# Altium schematic sheet Mainboard_Motordriver_Interface.SchDoc
size A4
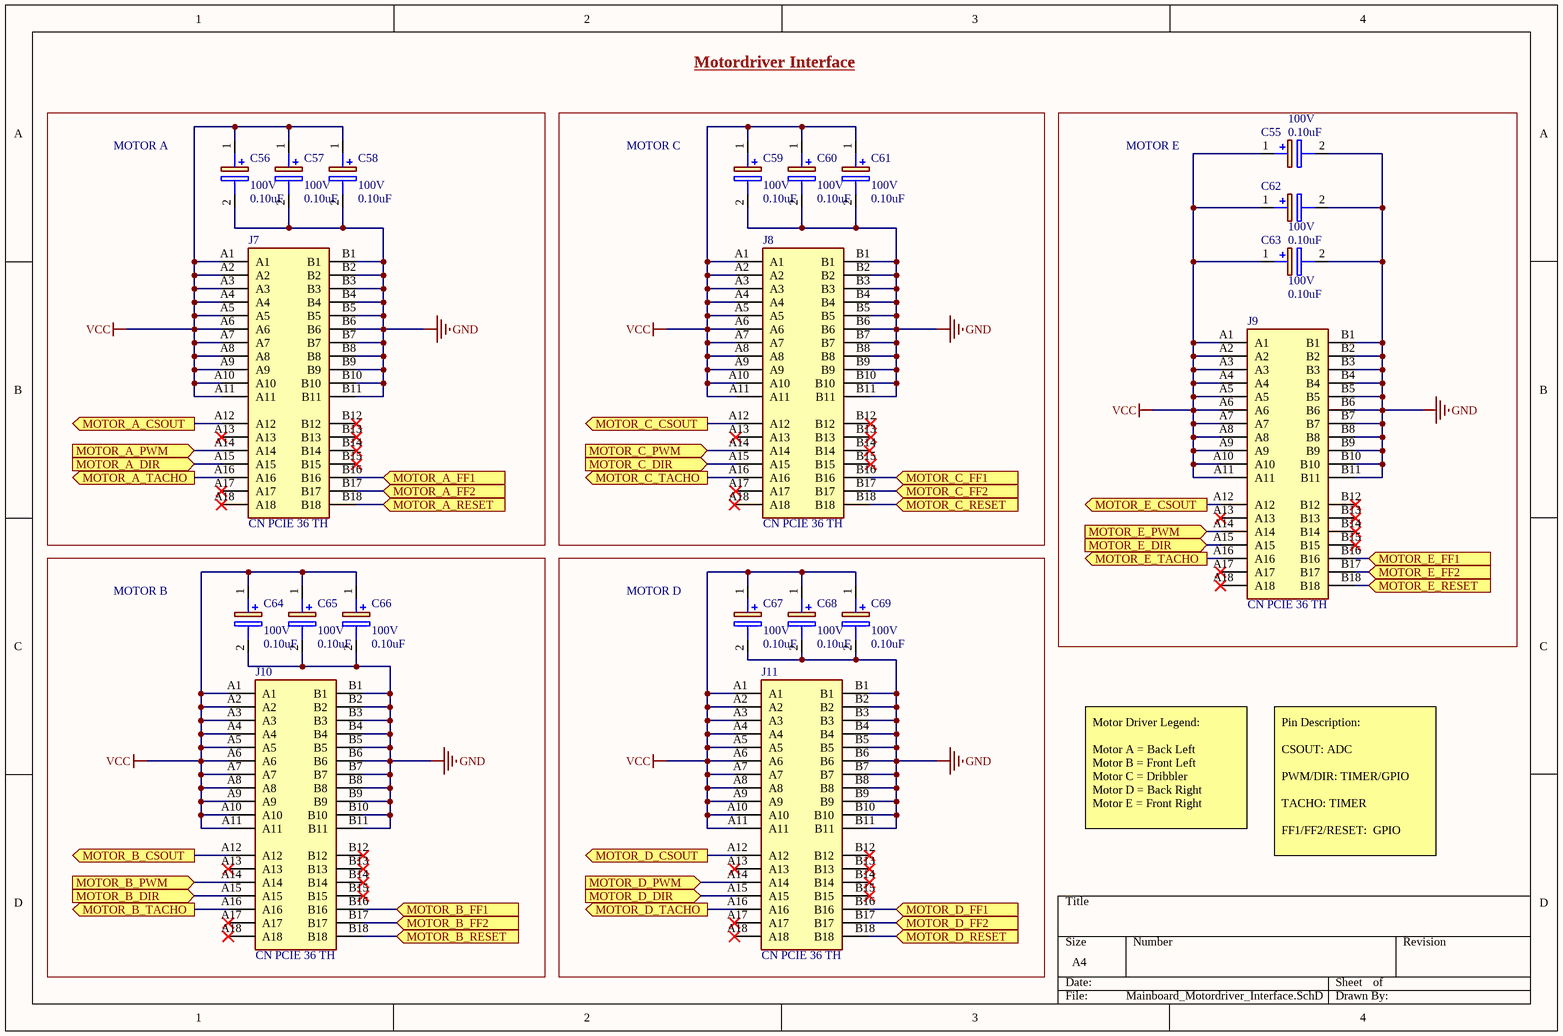
[diagram p0: Mainboard_Motordriver_Interface.SchDoc]

## Parts
C55  value 0.10uF  Rating: 100V  [CAPPRD200W50D525H1250]  (hidden comment: CAP POL 0.1uF 100V)
C56  value 0.10uF  Rating: 100V  [CAPPRD200W50D525H1250]  (hidden comment: CAP POL 0.1uF 100V)
C57  value 0.10uF  Rating: 100V  [CAPPRD200W50D525H1250]  (hidden comment: CAP POL 0.1uF 100V)
C58  value 0.10uF  Rating: 100V  [CAPPRD200W50D525H1250]  (hidden comment: CAP POL 0.1uF 100V)
C59  value 0.10uF  Rating: 100V  [CAPPRD200W50D525H1250]  (hidden comment: CAP POL 0.1uF 100V)
C60  value 0.10uF  Rating: 100V  [CAPPRD200W50D525H1250]  (hidden comment: CAP POL 0.1uF 100V)
C61  value 0.10uF  Rating: 100V  [CAPPRD200W50D525H1250]  (hidden comment: CAP POL 0.1uF 100V)
C62  value 0.10uF  Rating: 100V  [CAPPRD200W50D525H1250]  (hidden comment: CAP POL 0.1uF 100V)
C63  value 0.10uF  Rating: 100V  [CAPPRD200W50D525H1250]  (hidden comment: CAP POL 0.1uF 100V)
C64  value 0.10uF  Rating: 100V  [CAPPRD200W50D525H1250]  (hidden comment: CAP POL 0.1uF 100V)
C65  value 0.10uF  Rating: 100V  [CAPPRD200W50D525H1250]  (hidden comment: CAP POL 0.1uF 100V)
C66  value 0.10uF  Rating: 100V  [CAPPRD200W50D525H1250]  (hidden comment: CAP POL 0.1uF 100V)
C67  value 0.10uF  Rating: 100V  [CAPPRD200W50D525H1250]  (hidden comment: CAP POL 0.1uF 100V)
C68  value 0.10uF  Rating: 100V  [CAPPRD200W50D525H1250]  (hidden comment: CAP POL 0.1uF 100V)
C69  value 0.10uF  Rating: 100V  [CAPPRD200W50D525H1250]  (hidden comment: CAP POL 0.1uF 100V)
J7  CN PCIE 36 TH  [CN PCIE 36 TH]
J8  CN PCIE 36 TH  [CN PCIE 36 TH]
J9  CN PCIE 36 TH  [CN PCIE 36 TH]
J10  CN PCIE 36 TH  [CN PCIE 36 TH]
J11  CN PCIE 36 TH  [CN PCIE 36 TH]

## Blocks framed on the sheet
MOTOR A: C56-C58 J7
MOTOR C: C59-C61 J8
MOTOR E: C55 C62 C63 J9
MOTOR B: C64-C66 J10
MOTOR D: C67-C69 J11

## Ports
MOTOR_A_CSOUT (out), MOTOR_A_DIR (in), MOTOR_A_FF1 (in), MOTOR_A_FF2 (in), MOTOR_A_PWM (in), MOTOR_A_RESET (in), MOTOR_A_TACHO (out), MOTOR_B_CSOUT (out), MOTOR_B_DIR (in), MOTOR_B_FF1 (in), MOTOR_B_FF2 (in), MOTOR_B_PWM (in), MOTOR_B_RESET (in), MOTOR_B_TACHO (out), MOTOR_C_CSOUT (out), MOTOR_C_DIR (in), MOTOR_C_FF1 (in), MOTOR_C_FF2 (in), MOTOR_C_PWM (in), MOTOR_C_RESET (in), MOTOR_C_TACHO (out), MOTOR_D_CSOUT (out), MOTOR_D_DIR (in), MOTOR_D_FF1 (in), MOTOR_D_FF2 (in), MOTOR_D_PWM (in), MOTOR_D_RESET (in), MOTOR_D_TACHO (out), MOTOR_E_CSOUT (out), MOTOR_E_DIR (in), MOTOR_E_FF1 (in), MOTOR_E_FF2 (in), MOTOR_E_PWM (in), MOTOR_E_RESET (in), MOTOR_E_TACHO (out)

## Nets
GND: C55.2(-) C56.2(-) C57.2(-) C58.2(-) C59.2(-) C60.2(-) C61.2(-) C62.2(-) C63.2(-) C64.2(-) C65.2(-) C66.2(-) C67.2(-) C68.2(-) C69.2(-) J7.B1 J7.B2 J7.B3 J7.B4 J7.B5 J7.B6 J7.B7 J7.B8 J7.B9 J7.B10 J7.B11 J8.B1 J8.B2 J8.B3 J8.B4 J8.B5 J8.B6 J8.B7 J8.B8 J8.B9 J8.B10 J8.B11 J9.B1 J9.B2 J9.B3 J9.B4 J9.B5 J9.B6 J9.B7 J9.B8 J9.B9 J9.B10 J9.B11 J10.B1 J10.B2 J10.B3 J10.B4 J10.B5 J10.B6 J10.B7 J10.B8 J10.B9 J10.B10 J10.B11 J11.B1 J11.B2 J11.B3 J11.B4 J11.B5 J11.B6 J11.B7 J11.B8 J11.B9 J11.B10 J11.B11
VCC: C55.1(+) C56.1(+) C57.1(+) C58.1(+) C59.1(+) C60.1(+) C61.1(+) C62.1(+) C63.1(+) C64.1(+) C65.1(+) C66.1(+) C67.1(+) C68.1(+) C69.1(+) J7.A1 J7.A2 J7.A3 J7.A4 J7.A5 J7.A6 J7.A7 J7.A8 J7.A9 J7.A10 J7.A11 J8.A1 J8.A2 J8.A3 J8.A4 J8.A5 J8.A6 J8.A7 J8.A8 J8.A9 J8.A10 J8.A11 J9.A1 J9.A2 J9.A3 J9.A4 J9.A5 J9.A6 J9.A7 J9.A8 J9.A9 J9.A10 J9.A11 J10.A1 J10.A2 J10.A3 J10.A4 J10.A5 J10.A6 J10.A7 J10.A8 J10.A9 J10.A10 J10.A11 J11.A1 J11.A2 J11.A3 J11.A4 J11.A5 J11.A6 J11.A7 J11.A8 J11.A9 J11.A10 J11.A11
MOTOR_A_CSOUT: J7.A12 ; port MOTOR_A_CSOUT
MOTOR_A_DIR: J7.A15 ; port MOTOR_A_DIR
MOTOR_A_FF1: J7.B16 ; port MOTOR_A_FF1
MOTOR_A_FF2: J7.B17 ; port MOTOR_A_FF2
MOTOR_A_PWM: J7.A14 ; port MOTOR_A_PWM
MOTOR_A_RESET: J7.B18 ; port MOTOR_A_RESET
MOTOR_A_TACHO: J7.A16 ; port MOTOR_A_TACHO
MOTOR_B_CSOUT: J10.A12 ; port MOTOR_B_CSOUT
MOTOR_B_DIR: J10.A15 ; port MOTOR_B_DIR
MOTOR_B_FF1: J10.B16 ; port MOTOR_B_FF1
MOTOR_B_FF2: J10.B17 ; port MOTOR_B_FF2
MOTOR_B_PWM: J10.A14 ; port MOTOR_B_PWM
MOTOR_B_RESET: J10.B18 ; port MOTOR_B_RESET
MOTOR_B_TACHO: J10.A16 ; port MOTOR_B_TACHO
MOTOR_C_CSOUT: J8.A12 ; port MOTOR_C_CSOUT
MOTOR_C_DIR: J8.A15 ; port MOTOR_C_DIR
MOTOR_C_FF1: J8.B16 ; port MOTOR_C_FF1
MOTOR_C_FF2: J8.B17 ; port MOTOR_C_FF2
MOTOR_C_PWM: J8.A14 ; port MOTOR_C_PWM
MOTOR_C_RESET: J8.B18 ; port MOTOR_C_RESET
MOTOR_C_TACHO: J8.A16 ; port MOTOR_C_TACHO
MOTOR_D_CSOUT: J11.A12 ; port MOTOR_D_CSOUT
MOTOR_D_DIR: J11.A15 ; port MOTOR_D_DIR
MOTOR_D_FF1: J11.B16 ; port MOTOR_D_FF1
MOTOR_D_FF2: J11.B17 ; port MOTOR_D_FF2
MOTOR_D_PWM: J11.A14 ; port MOTOR_D_PWM
MOTOR_D_RESET: J11.B18 ; port MOTOR_D_RESET
MOTOR_D_TACHO: J11.A16 ; port MOTOR_D_TACHO
MOTOR_E_CSOUT: J9.A12 ; port MOTOR_E_CSOUT
MOTOR_E_DIR: J9.A15 ; port MOTOR_E_DIR
MOTOR_E_FF1: J9.B16 ; port MOTOR_E_FF1
MOTOR_E_FF2: J9.B17 ; port MOTOR_E_FF2
MOTOR_E_PWM: J9.A14 ; port MOTOR_E_PWM
MOTOR_E_RESET: J9.B18 ; port MOTOR_E_RESET
MOTOR_E_TACHO: J9.A16 ; port MOTOR_E_TACHO

Not connected (* = marked no-connect by the designer): J7 A13* A17* A18* B12* B13* B14* B15*; J8 A13* A17* A18 B12* B13* B14 B15*; J9 A13* A17* A18* B12* B13* B14* B15*; J10 A13* A17* A18* B12* B13* B14* B15*; J11 A13* A17* A18* B12* B13* B14* B15*

## Notes on the sheet
- Motordriver Interface
- Motor Driver Legend:
  Motor A = Back Left
  Motor B = Front Left
  Motor C = Dribbler
  Motor D = Back Right
  Motor E = Front Right
- Pin Description:
  CSOUT: ADC
  PWM/DIR: TIMER/GPIO
  TACHO: TIMER
  FF1/FF2/RESET:  GPIO

## Library data of the parts
C55-C69 = CAP POL 0.1uF 100V: 0.1µF 100V Aluminum Electrolytic Capacitors, Through-Hole, Radial, Can 2000 Hrs @ 85°C; Manufacturer_Name: Nichicon; Manufacturer_Part_Number: UKL2A0R1KDD; Datasheet Link: http://www.mouser.com/ds/2/293/e-ukl-876305.pdf; Height: 12.5mm; Mouser Part Number: 647-UKL2A0R1KDD; Mouser Price/Stock: https://www.mouser.com/Search/Refine.aspx?Keyword=647-UKL2A0R1KDD; Supplier 1: Digi-Key; Supplier Part Number 1: 493-16876-ND
J7-J11 = CN PCIE 36 TH: 36 Position Female Connector PCI Expressâ„¢ Gold 0.039 _1.00mm_ Black 10018784-10210TLF; MF: Amphenol ICC; Price: None; SnapEDA_Link: https://www.snapeda.com/parts/10018784-10210TLF/Amphenol%20FCI/view-part/520950/?ref=snap; Availability: Unavailable; MP: 10018784-10210TLF; Package: None; Value: *